# Altium project Scoreboard.PrjPcb
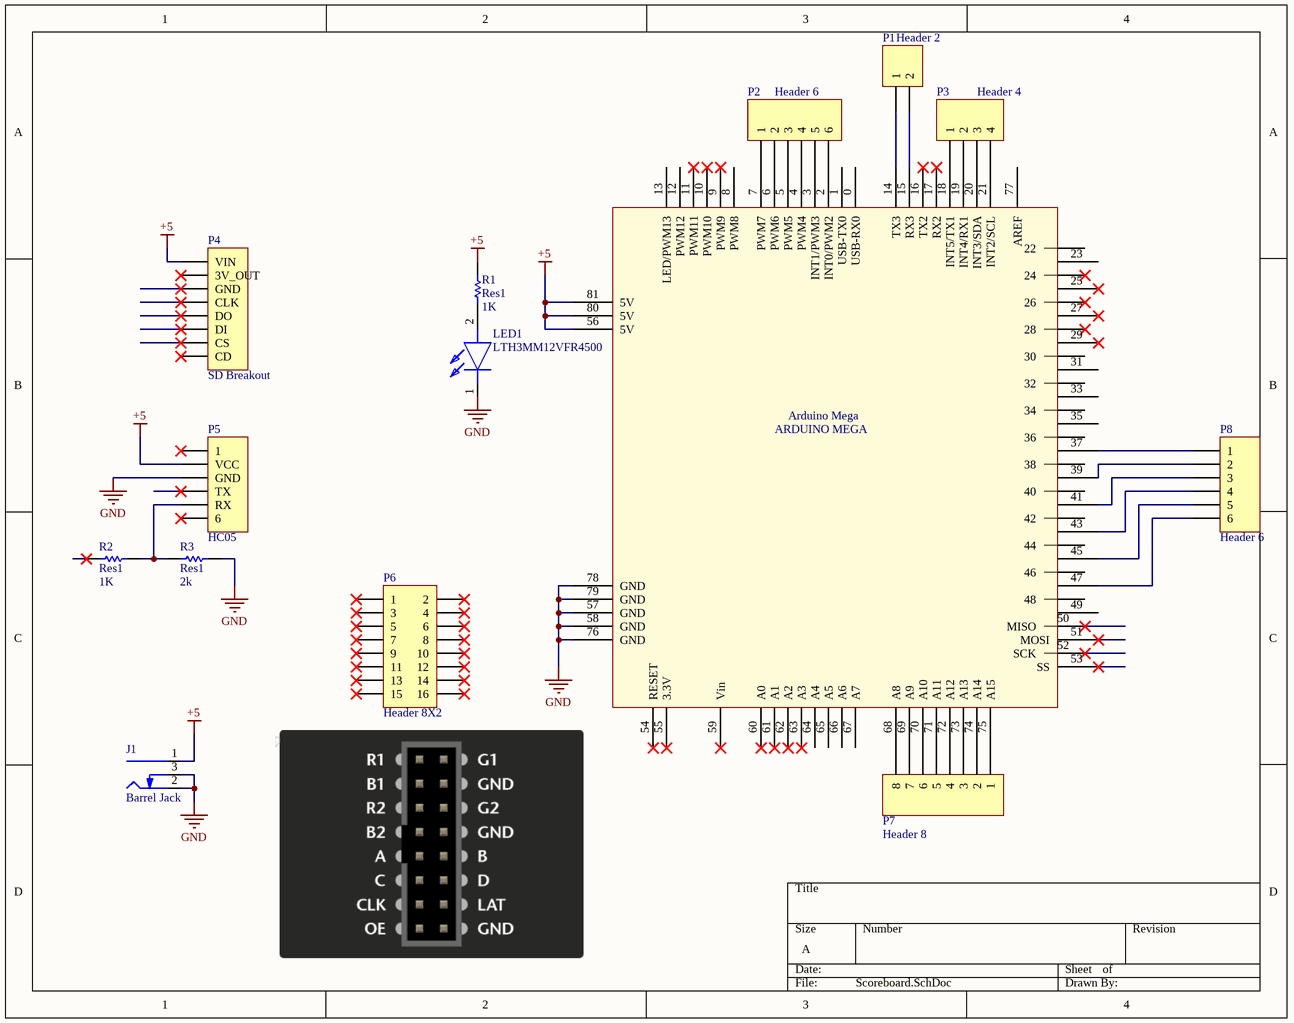
[diagram p0: Scoreboard.SchDoc]
2 sheets, 31 parts. Net scope: global (net labels, ports and power ports of the same name join across sheets).
Board files: Scoreboard.PcbDoc, Remote.PcbDoc
Sheets:
  Scoreboard.SchDoc
  Remote.SchDoc

## Sheet Scoreboard.SchDoc
size A; SheetNumber: 1; SheetTotal: 2

### Parts
Arduino_Mega  ARDUINO MEGA  [ARDUINO MEGA]
J1  Barrel Jack  [PCB - CONNECTOR - BARREL - CUI PJ-102]
LED1  LTH3MM12VFR4500  [LTH3MM12VFR4500]
P1  Header 2  [HDR1X2]
P2  Header 6  [HDR1X6]
P3  Header 4  [HDR1X4]
P4  SD Breakout  [HDR1X8]
P5  HC05  [HDR1X6]
P6  Header 8X2  [HDR2X8]
P7  Header 8  [HDR1X8]
P8  Header 6  [HDR1X6]
R1  Res1  value 1K  [AXIAL-0.3]
R2  Res1  value 1K  [AXIAL-0.3]
R3  Res1  value 2k  [AXIAL-0.3]

### Nets
+5: Arduino_Mega.56(5V) Arduino_Mega.80(5V) Arduino_Mega.81(5V) J1.1(Centre) P4.1(VIN) P5.2(VCC) R1.2
GND: Arduino_Mega.57(GND) Arduino_Mega.58(GND) Arduino_Mega.76(GND) Arduino_Mega.78(GND) Arduino_Mega.79(GND) J1.2(Outer) J1.3(SW) LED1.1(K) P5.3(GND) R3.2
NetArduino_Mega_2: Arduino_Mega.2(INT0/PWM2) P2.6
NetArduino_Mega_3: Arduino_Mega.3(INT1/PWM3) P2.5
NetArduino_Mega_4: Arduino_Mega.4(PWM4) P2.4
NetArduino_Mega_5: Arduino_Mega.5(PWM5) P2.3
NetArduino_Mega_6: Arduino_Mega.6(PWM6) P2.2
NetArduino_Mega_7: Arduino_Mega.7(PWM7) P2.1
NetArduino_Mega_14: Arduino_Mega.14(TX3) P1.1
NetArduino_Mega_15: Arduino_Mega.15(RX3) P1.2
NetArduino_Mega_18: Arduino_Mega.18(INT5/TX1) P3.1
NetArduino_Mega_19: Arduino_Mega.19(INT4/RX1) P3.2
NetArduino_Mega_20: Arduino_Mega.20(INT3/SDA) P3.3
NetArduino_Mega_21: Arduino_Mega.21(INT2/SCL) P3.4
NetArduino_Mega_37: Arduino_Mega.37 P8.1
NetArduino_Mega_39: Arduino_Mega.39 P8.2
NetArduino_Mega_41: Arduino_Mega.41 P8.3
NetArduino_Mega_43: Arduino_Mega.43 P8.4
NetArduino_Mega_45: Arduino_Mega.45 P8.5
NetArduino_Mega_47: Arduino_Mega.47 P8.6
NetArduino_Mega_68: Arduino_Mega.68(A8) P7.8
NetArduino_Mega_69: Arduino_Mega.69(A9) P7.7
NetArduino_Mega_70: Arduino_Mega.70(A10) P7.6
NetArduino_Mega_71: Arduino_Mega.71(A11) P7.5
NetArduino_Mega_72: Arduino_Mega.72(A12) P7.4
NetArduino_Mega_73: Arduino_Mega.73(A13) P7.3
NetArduino_Mega_74: Arduino_Mega.74(A14) P7.2
NetArduino_Mega_75: Arduino_Mega.75(A15) P7.1
NetLED1_2: LED1.2(A) R1.1
NetP5_5: P5.5(RX) R2.1 R3.1

Not connected (* = marked no-connect by the designer): Arduino_Mega 0(USB-RX0) 1(USB-TX0) 8(PWM8) 9(PWM9)* 10(PWM10)* 11(PWM11)* 12(PWM12) 13(LED/PWM13) 16(TX2)* 17(RX2)* 22 23 24* 25* 26* 27* 28* 29* 30 31 32 33 34 35 36 38 40 42 44 46 48 49 50(MISO)* 51(MOSI)* 52(SCK)* 53(SS)* 54(RESET)* 55(3.3V)* 59(Vin)* 60(A0)* 61(A1)* 62(A2)* 63(A3)* 64(A4) 65(A5) 66(A6) 67(A7) 77(AREF); P4 2(3V_OUT)* 3(GND)* 4(CLK)* 5(DO)* 6(DI)* 7(CS)* 8(CD)*; P5 1* 4(TX)* 6*; P6 1* 2* 3* 4* 5* 6* 7* 8* 9* 10* 11* 12* 13* 14* 15* 16*; R2 2*

### Library data of the parts
J1 = 1341: Power Barrel Connector Jack 2.50mm ID (0.098&quot;), 5.50mm OD (0.217&quot;) Through Hole, Right Angle; Rowan Part Number: 1341; Manufacturer: CUI Devices; Manufacturer part number: PJ-102B; Name: Barrel Jack 2.5mmx5.5mm; Supplier 1: Digi-Key; Supplier Part Number 1: CP-102B-ND; Category: Connectors; Datasheet: https://www.cuidevices.com/product/resource/digikeypdf/pj-102b.pdf; Status: Active
LED1 = LTH3MM12VFR4500: LED RED; Manufacturer_Name: Visual Communications Company; Datasheet Link: https://vcclite.com/wp-content/uploads/wpallimport/files/files/LTH3MM12VFR4500.pdf; Height: 5.55mm; Manufacturer_Part_Number: LTH3MM12VFR4500; Mouser Part Number: 593-LTH3MM12VFR4500; Mouser Price/Stock: https://www.mouser.co.uk/ProductDetail/VCC/LTH3MM12VFR4500?qs=Mv7BduZupUhMUueo6XymDw%3D%3D; Arrow Part Number: LTH3MM12VFR4500; Arrow Price/Stock: https://www.arrow.com/en/products/lth3mm12vfr4500/visual-communications?region=nac
P1 = Header 2: Header, 2-Pin; LatestRevisionDate: 17-Jul-2002; LatestRevisionNote: Re-released for DXP Platform.; Publisher: Altium Limited
P2 P5 P8 = Header 6: Header, 6-Pin; LatestRevisionDate: 17-Jul-2002; LatestRevisionNote: Re-released for DXP Platform.; Publisher: Altium Limited
P3 = Header 4: Header, 4-Pin; LatestRevisionDate: 17-Jul-2002; LatestRevisionNote: Re-released for DXP Platform.; Publisher: Altium Limited
P4 P7 = Header 8: Header, 8-Pin; LatestRevisionDate: 17-Jul-2002; LatestRevisionNote: Re-released for DXP Platform.; Publisher: Altium Limited
P6 = Header 8X2: Header, 8-Pin, Dual row; LatestRevisionDate: 17-Jul-2002; LatestRevisionNote: Re-released for DXP Platform.; Publisher: Altium Limited
R1-R3 = Res1: Resistor; Published: 8-Jun-2000; LatestRevisionDate: 17-Jul-2002; LatestRevisionNote: Re-released for DXP Platform.; PackageReference: AXIAL-0.3; Publisher: Altium Limited; PackageDescription: Axial Device, Thru-Hole; 2 Leads; 0.3 in Pin Spacing

## Sheet Remote.SchDoc
size A; SheetNumber: 2; SheetTotal: 2
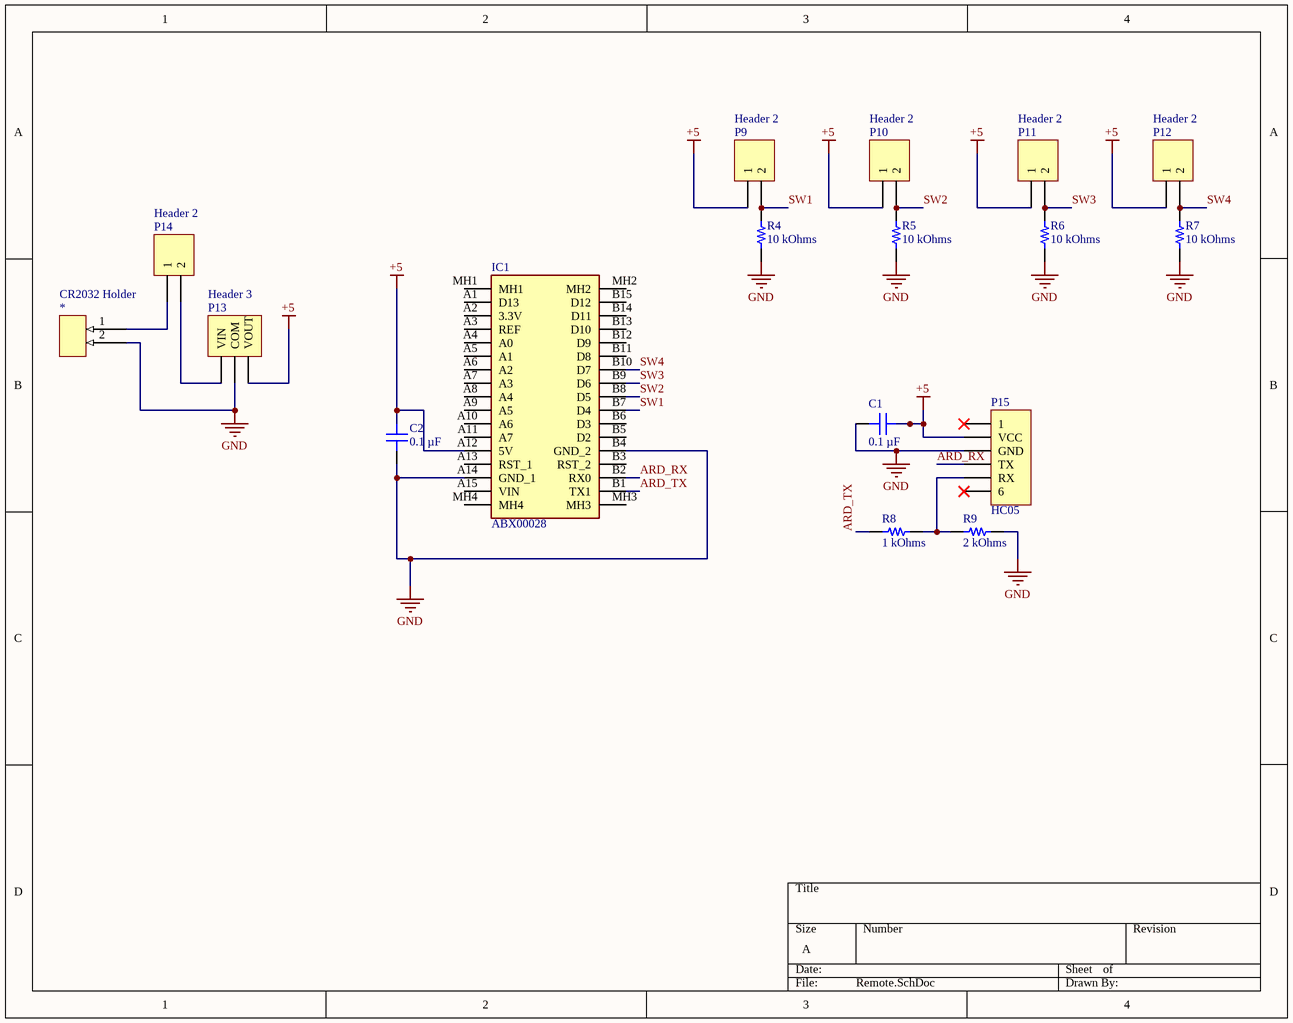
[diagram p1: Remote.SchDoc]

### Parts
*  CR2032 Holder  [CR2032 Holder-Footprint-1]
C1  0.1 µF  [CAP 1206_3216 - 0.8MM]
C2  0.1 µF  [CAP 1206_3216 - 0.8MM]
IC1  ABX00028  [ABX00028]
P9  Header 2  [HDR1X2]
P10  Header 2  [HDR1X2]
P11  Header 2  [HDR1X2]
P12  Header 2  [HDR1X2]
P13  Header 3  [HDR1X3]
P14  Header 2  [HDR1X2]
P15  HC05  [HDR1X6]
R4  10 kOhms  [RES 1206_3216]
R5  10 kOhms  [RES 1206_3216]
R6  10 kOhms  [RES 1206_3216]
R7  10 kOhms  [RES 1206_3216]
R8  1 kOhms  [RES 1206_3216]
R9  2 kOhms  [RES 1206_3216]

### Nets
+5: C1.2 C2.2 IC1.A12(5V) P9.1 P10.1 P11.1 P12.1 P13.3(VOUT) P15.2(VCC)
GND: *.2 C1.1 C2.1 IC1.A14(GND_1) IC1.B4(GND_2) P13.2(COM) P15.3(GND) R4.1 R5.1 R6.1 R7.1 R9.2
ARD_RX: IC1.B2(RX0) P15.4(TX)
ARD_TX: IC1.B1(TX1) R8.1
SW1: IC1.B7(D4) P9.2 R4.2
SW2: IC1.B8(D5) P10.2 R5.2
SW3: IC1.B9(D6) P11.2 R6.2
SW4: IC1.B10(D7) P12.2 R7.2
Net*_1: *.1 P14.1
NetP13_1: P13.1(VIN) P14.2
NetP15_5: P15.5(RX) R8.2 R9.1

Not connected (* = marked no-connect by the designer): IC1 A1(D13) A2(3.3V) A3(REF) A4(A0) A5(A1) A6(A2) A7(A3) A8(A4) A9(A5) A10(A6) A11(A7) A13(RST_1) A15(VIN) B3(RST_2) B5(D2) B6(D3) B11(D8) B12(D9) B13(D10) B14(D11) B15(D12) MH1 MH2 MH3 MH4; P15 1* 6*

### Library data of the parts
* = CMP-00005-2: Coin cell battery holder
C1 C2 = CC1206MRY5V9BB104: CAP CER 0.1UF 50V Y5V 1206; manufacturer: Yageo; Temperature Coefficient: Y5V (F); Tolerance: ±20%; Part Number: CC1206MRY5V9BB104; Value: 0.1 µF; Applications: General Purpose; Capacitance: 0.1 µF; componentlink1description: Datasheet; componentlink1url: http://www.yageo.com/documents/recent/UPY-GPHC_Y5V_6.3V-to-50V_8.pdf; componentlink2description: DigiKey Link; componentlink2url: https://www.digikey.com/en/products/detail/yageo/CC1206MRY5V9BB104/5884674; Device Package: 1206 (3216 Metric); lastupdated: 5/13/2023 7:18:07 PM; Lifecycle Status: Active; Minimum Order: 1; Mounting Type: Surface Mount, MLCC; Operating Temperature: -30°C ~ 85°C; Package / Case: 1206 (3216 Metric); packaging: TapeAndReel; partid: 18711; Part Status: Active; price: 0.04; series: CC; Size / Dimension: 0.126" L x 0.063" W (3.20mm x 1.60mm); Supplier 1: DigiKey; Supplier Part Number 1: 311-4504-1-ND; Thickness (Max): 0.028" (0.70mm); Voltage - Rated: 50V
IC1 = ABX00028: Integrated Circuit; Manufacturer_Name: Arduino; Datasheet Link: https://store.arduino.cc/arduino-nano-every; Height: 10mm; Manufacturer_Part_Number: ABX00028; Mouser Part Number: 782-ABX00028; Mouser Price/Stock: https://www.mouser.co.uk/ProductDetail/Arduino/ABX00028?qs=PzGy0jfpSMtit6rnFl8mVg%3D%3D; Arrow Part Number: ABX00028; Arrow Price/Stock: https://www.arrow.com/en/products/abx00028/arduino-corporation?region=nac
P9-P12 P14 = Header 2: Header, 2-Pin; LatestRevisionDate: 17-Jul-2002; LatestRevisionNote: Re-released for DXP Platform.; Publisher: Altium Limited
P13 = Header 3: Header, 3-Pin; LatestRevisionDate: 17-Jul-2002; LatestRevisionNote: Re-released for DXP Platform.; Publisher: Altium Limited
P15 = Header 6: Header, 6-Pin; LatestRevisionDate: 17-Jul-2002; LatestRevisionNote: Re-released for DXP Platform.; Publisher: Altium Limited
R4-R7 = CRG1206F10K: RES SMD 10K OHM 1% 1/4W 1206; Manufacturer: TE Connectivity Passive Product; Power (Watts): 0.25W, 1/4W; Temperature Coefficient: ±100ppm/°C; Part Number: CRG1206F10K; ComponentLink1Description: Datasheet; ComponentLink1URL: https://www.te.com/commerce/DocumentDelivery/DDEController?Action=srchrtrv&DocNm=1773204&DocType=DS&DocLang=English; ComponentLink2Description: DigiKey Link; ComponentLink2URL: https://www.digikey.com/en/products/detail/te-connectivity-passive-product/CRG1206F10K/2389909; Composition: Thick Film; Device Package: 1206 (3216 Metric); Height - Seated (Max): 0.026" (0.65mm); LastUpdated: 5/13/2023 7:46:04 PM; Lifecycle Status: Active; Minimum Order: 1; Number of Terminations: 2; Operating Temperature: -55°C ~ 155°C; Package / Case: 1206 (3216 Metric); Packaging: TapeAndReel; PartId: 26989; Part Status: Active; Price: 0.01; Resistance: 10 kOhms; Series: CRG, Neohm; Size / Dimension: 0.122" L x 0.061" W (3.10mm x 1.55mm); Supplier 1: DigiKey; Supplier Part Number 1: A106069CT-ND; Supplier Device Package: 1206; Tolerance: ±1%; Value: 10 kOhms
R8 = RNCS1206BKE1K00: RES 1K OHM 0.1% 1/8W 1206; Manufacturer: Stackpole Electronics Inc; Power (Watts): 0.125W, 1/8W; Temperature Coefficient: ±25ppm/°C; Part Number: RNCS1206BKE1K00; ComponentLink1Description: Datasheet; ComponentLink1URL: https://www.seielect.com/catalog/sei-rncs_rnch.pdf; ComponentLink2Description: DigiKey Link; ComponentLink2URL: https://www.digikey.com/en/products/detail/stackpole-electronics-inc/RNCS1206BKE1K00/1800333; Composition: Thin Film; Device Package: 1206 (3216 Metric); Features: Anti-Corrosive, Automotive AEC-Q200, Moisture Resistant; Height - Seated (Max): 0.026" (0.65mm); LastUpdated: 5/13/2023 7:46:05 PM; Lifecycle Status: Active; Minimum Order: 1; Number of Terminations: 2; Operating Temperature: -55°C ~ 155°C; Package / Case: 1206 (3216 Metric); Packaging: TapeAndReel; PartId: 26856; Part Status: Active; Price: 0.08; Ratings: AEC-Q200; Resistance: 1 kOhms; Series: RNCS; Size / Dimension: 0.120" L x 0.061" W (3.05mm x 1.55mm); Supplier 1: DigiKey; Supplier Part Number 1: RNCS1206BKE1K00CT-ND; Supplier Device Package: 1206; Tolerance: ±0.1%; Value: 1 kOhms
R9 = AC1206JR-072KL: RES SMD 2K OHM 5% 1/4W 1206; Manufacturer: Yageo; Power (Watts): 0.25W, 1/4W; Temperature Coefficient: ±100ppm/°C; Part Number: AC1206JR-072KL; ComponentLink1Description: Datasheet; ComponentLink1URL: https://www.yageo.com/upload/media/product/productsearch/datasheet/rchip/PYu-AC_51_RoHS_L_7.pdf; ComponentLink2Description: DigiKey Link; ComponentLink2URL: https://www.digikey.com/en/products/detail/yageo/AC1206JR-072KL/5897821; Composition: Thick Film; Device Package: 1206 (3216 Metric); Features: Automotive AEC-Q200, Moisture Resistant; Height - Seated (Max): 0.026" (0.65mm); LastUpdated: 5/13/2023 7:46:03 PM; Lifecycle Status: Active; Minimum Order: 1; Number of Terminations: 2; Operating Temperature: -55°C ~ 155°C; Package / Case: 1206 (3216 Metric); Packaging: TapeAndReel; PartId: 27112; Part Status: Active; Price: 0.01; Ratings: AEC-Q200; Resistance: 2 kOhms; Series: AC; Size / Dimension: 0.122" L x 0.063" W (3.10mm x 1.60mm); Supplier 1: DigiKey; Supplier Part Number 1: YAG3946CT-ND; Supplier Device Package: 1206; Tolerance: ±5%; Value: 2 kOhms

## Nets that join several sheets
+5: Scoreboard (7 pins), Remote (9 pins)
GND: Scoreboard (10 pins), Remote (12 pins)